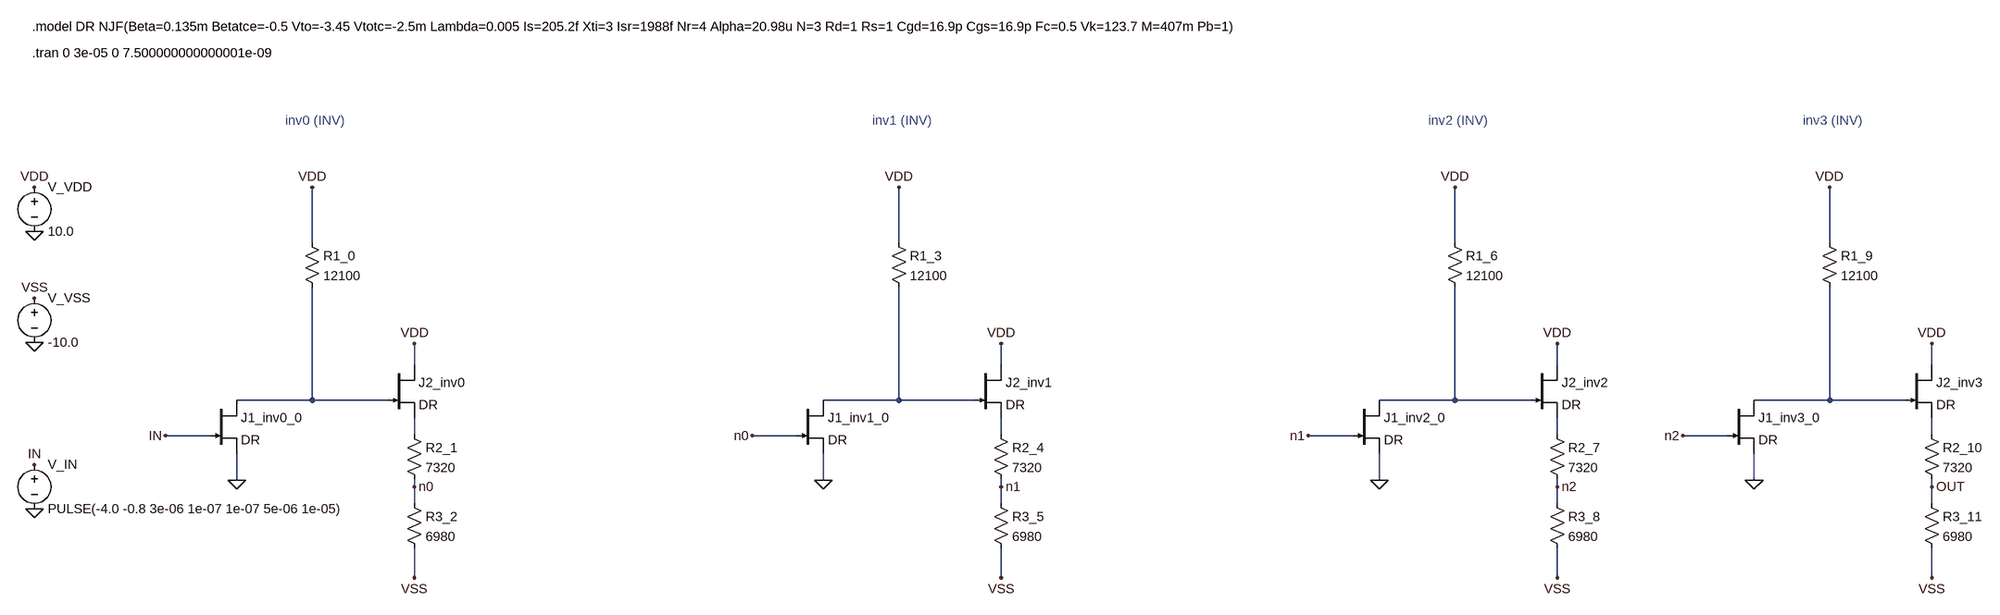
[diagram p0: schematic inv_chain_4_v3.asc]
inv_chain_4_v3.asc, the LTspice schematic file:
Version 4
SHEET 1 10000 10000
WIRE 0 116 0 16
WIRE 0 400 0 196
WIRE 0 400 -136 400
WIRE 136 400 0 400
WIRE 184 336 184 298
WIRE 184 462 184 432
WIRE -136 544 -136 496
WIRE 184 556 184 542
WIRE 184 586 184 556
WIRE 184 720 184 666
WIRE -184 464 -264 464
FLAG 0 16 VDD
FLAG 184 298 VDD
FLAG 184 556 n0
FLAG 184 720 VSS
FLAG -136 544 0
FLAG -264 464 IN
SYMBOL res -16 100 R0
SYMATTR InstName R1_0
SYMATTR Value 12100
SYMBOL njf -184 400 R0
SYMATTR InstName J1_inv0_0
SYMATTR Value DR
SYMBOL njf 136 336 R0
SYMATTR InstName J2_inv0
SYMATTR Value DR
SYMBOL res 168 446 R0
SYMATTR InstName R2_1
SYMATTR Value 7320
SYMBOL res 168 570 R0
SYMATTR InstName R3_2
SYMATTR Value 6980
TEXT -48 -104 Left 2 ;inv0 (INV)
WIRE 1056 116 1056 16
WIRE 1056 400 1056 196
WIRE 1056 400 920 400
WIRE 1192 400 1056 400
WIRE 1240 336 1240 298
WIRE 1240 462 1240 432
WIRE 920 544 920 496
WIRE 1240 556 1240 542
WIRE 1240 586 1240 556
WIRE 1240 720 1240 666
WIRE 872 464 792 464
FLAG 1056 16 VDD
FLAG 1240 298 VDD
FLAG 1240 556 n1
FLAG 1240 720 VSS
FLAG 920 544 0
FLAG 792 464 n0
SYMBOL res 1040 100 R0
SYMATTR InstName R1_3
SYMATTR Value 12100
SYMBOL njf 872 400 R0
SYMATTR InstName J1_inv1_0
SYMATTR Value DR
SYMBOL njf 1192 336 R0
SYMATTR InstName J2_inv1
SYMATTR Value DR
SYMBOL res 1224 446 R0
SYMATTR InstName R2_4
SYMATTR Value 7320
SYMBOL res 1224 570 R0
SYMATTR InstName R3_5
SYMATTR Value 6980
TEXT 1008 -104 Left 2 ;inv1 (INV)
WIRE 2112 116 2112 16
WIRE 2112 400 2112 196
WIRE 2112 400 1976 400
WIRE 2248 400 2112 400
WIRE 2296 336 2296 298
WIRE 2296 462 2296 432
WIRE 1976 544 1976 496
WIRE 2296 556 2296 542
WIRE 2296 586 2296 556
WIRE 2296 720 2296 666
WIRE 1928 464 1848 464
FLAG 2112 16 VDD
FLAG 2296 298 VDD
FLAG 2296 556 n2
FLAG 2296 720 VSS
FLAG 1976 544 0
FLAG 1848 464 n1
SYMBOL res 2096 100 R0
SYMATTR InstName R1_6
SYMATTR Value 12100
SYMBOL njf 1928 400 R0
SYMATTR InstName J1_inv2_0
SYMATTR Value DR
SYMBOL njf 2248 336 R0
SYMATTR InstName J2_inv2
SYMATTR Value DR
SYMBOL res 2280 446 R0
SYMATTR InstName R2_7
SYMATTR Value 7320
SYMBOL res 2280 570 R0
SYMATTR InstName R3_8
SYMATTR Value 6980
TEXT 2064 -104 Left 2 ;inv2 (INV)
WIRE 3168 116 3168 16
WIRE 3168 400 3168 196
WIRE 3168 400 3032 400
WIRE 3304 400 3168 400
WIRE 3352 336 3352 298
WIRE 3352 462 3352 432
WIRE 3032 544 3032 496
WIRE 3352 556 3352 542
WIRE 3352 586 3352 556
WIRE 3352 720 3352 666
WIRE 2984 464 2904 464
FLAG 3168 16 VDD
FLAG 3352 298 VDD
FLAG 3352 556 OUT
FLAG 3352 720 VSS
FLAG 3032 544 0
FLAG 2904 464 n2
SYMBOL res 3152 100 R0
SYMATTR InstName R1_9
SYMATTR Value 12100
SYMBOL njf 2984 400 R0
SYMATTR InstName J1_inv3_0
SYMATTR Value DR
SYMBOL njf 3304 336 R0
SYMATTR InstName J2_inv3
SYMATTR Value DR
SYMBOL res 3336 446 R0
SYMATTR InstName R2_10
SYMATTR Value 7320
SYMBOL res 3336 570 R0
SYMATTR InstName R3_11
SYMATTR Value 6980
TEXT 3120 -104 Left 2 ;inv3 (INV)
FLAG -500 16 VDD
FLAG -500 96 0
SYMBOL voltage -500 0 R0
SYMATTR InstName V_VDD
SYMATTR Value 10.0
FLAG -500 216 VSS
FLAG -500 296 0
SYMBOL voltage -500 200 R0
SYMATTR InstName V_VSS
SYMATTR Value -10.0
FLAG -500 516 IN
FLAG -500 596 0
SYMBOL voltage -500 500 R0
SYMATTR InstName V_IN
SYMATTR Value PULSE(-4.0 -0.8 3e-06 1e-07 1e-07 5e-06 1e-05)
TEXT -504 -304 Left 2 !.tran 0 3e-05 0 7.500000000000001e-09
TEXT -504 -352 Left 2 !.model DR NJF(Beta=0.135m Betatce=-0.5 Vto=-3.45 Vtotc=-2.5m Lambda=0.005 Is=205.2f Xti=3 Isr=1988f Nr=4 Alpha=20.98u N=3 Rd=1 Rs=1 Cgd=16.9p Cgs=16.9p Fc=0.5 Vk=123.7 M=407m Pb=1)

The netlist it stands for:
* inv_chain_4_v3.asc
R1_0 VDD N001 12100
J1_inv0_0 N001 IN 0 DR
J2_inv0 VDD N001 N002 DR
R2_1 N002 n0 7320
R3_2 n0 VSS 6980
R1_3 VDD N003 12100
J1_inv1_0 N003 n0 0 DR
J2_inv1 VDD N003 N004 DR
R2_4 N004 n1 7320
R3_5 n1 VSS 6980
R1_6 VDD N005 12100
J1_inv2_0 N005 n1 0 DR
J2_inv2 VDD N005 N006 DR
R2_7 N006 n2 7320
R3_8 n2 VSS 6980
R1_9 VDD N007 12100
J1_inv3_0 N007 n2 0 DR
J2_inv3 VDD N007 N008 DR
R2_10 N008 OUT 7320
R3_11 OUT VSS 6980
V_VDD VDD 0 10.0
V_VSS VSS 0 -10.0
V_IN IN 0 PULSE(-4.0 -0.8 3e-06 1e-07 1e-07 5e-06 1e-05)
.model NJF NJF
.model PJF PJF
.lib standard.jft
* inv0 (INV)
* inv1 (INV)
* inv2 (INV)
* inv3 (INV)
.tran 0 3e-05 0 7.500000000000001e-09
.model DR NJF(Beta=0.135m Betatce=-0.5 Vto=-3.45 Vtotc=-2.5m Lambda=0.005 Is=205.2f Xti=3 Isr=1988f Nr=4 Alpha=20.98u N=3 Rd=1 Rs=1 Cgd=16.9p Cgs=16.9p Fc=0.5 Vk=123.7 M=407m Pb=1)
.backanno
.end